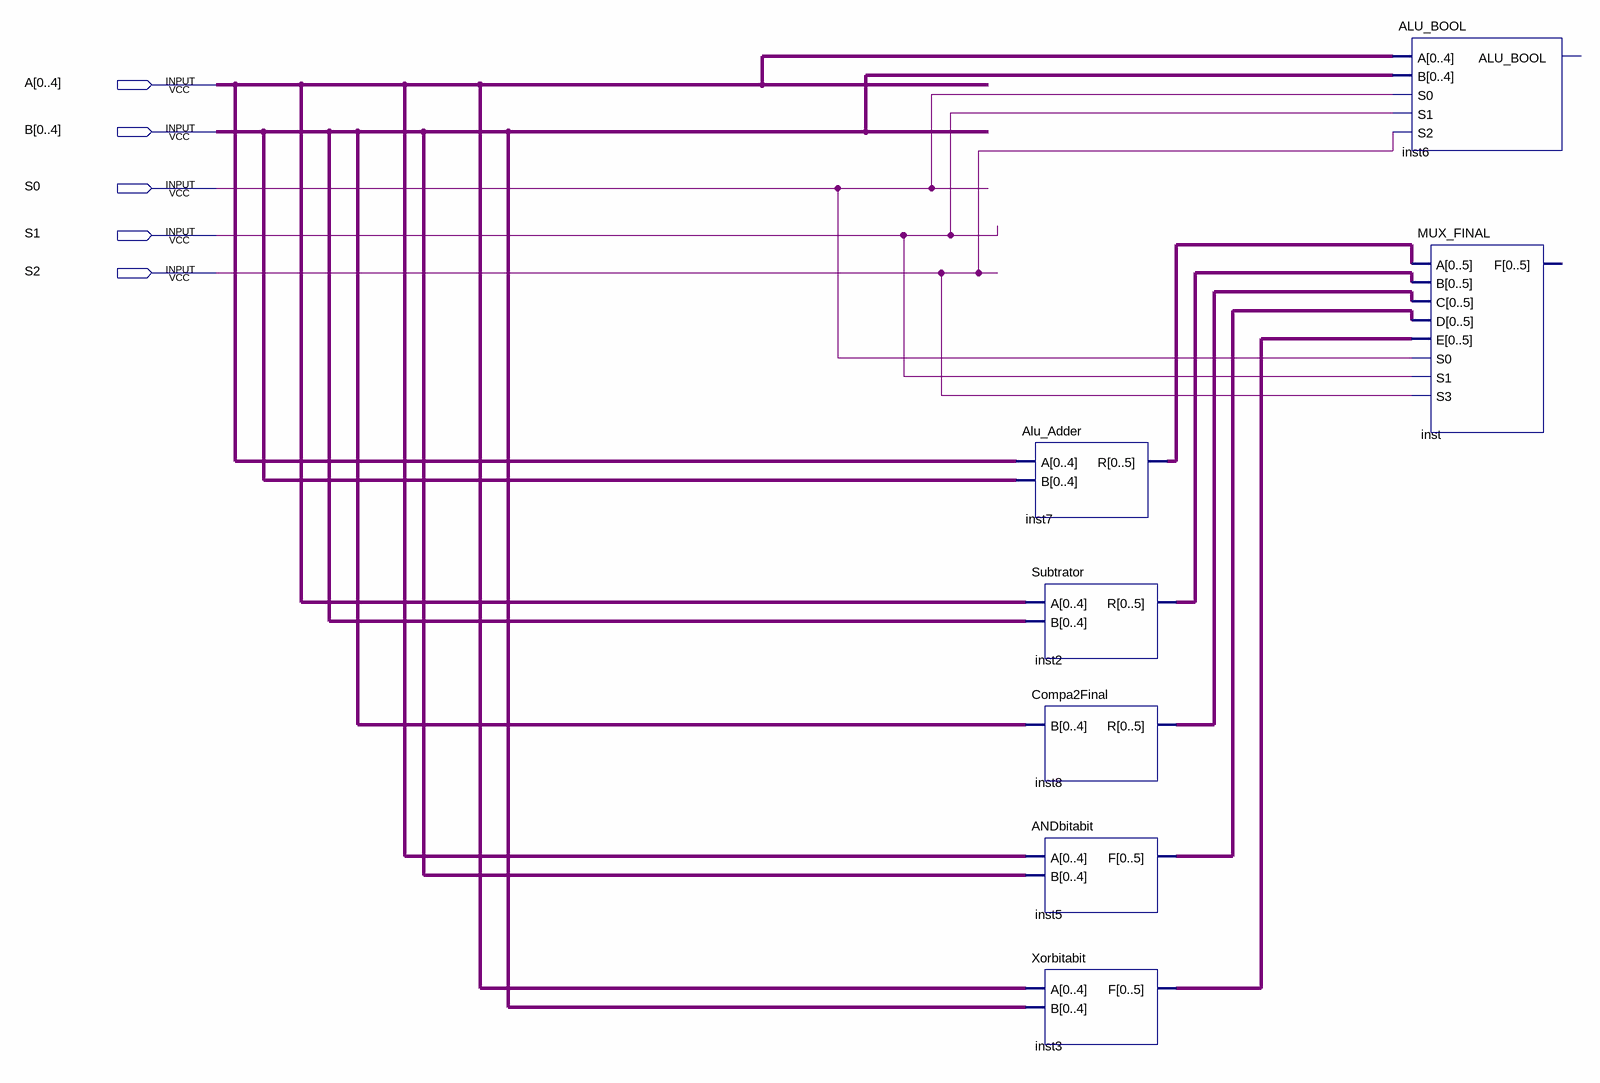
[diagram p0: schematic sheet]
// Quartus schematic alura_final.bdf as structural Verilog: 7 symbols, 5 pins
module alura_final (
  input  [0:4] A,
  input  [0:4] B,
  input  S0,
  input  S1,
  input  S2
);

  wire [5:0] inst2_r, inst3_f, inst5_f, inst7_r, inst8_r;

  Alu_Adder inst7 (.A(A), .B(B), .R(inst7_r));
  Subtrator inst2 (.A(A), .B(B), .R(inst2_r));
  Compa2Final inst8 (.B(B), .R(inst8_r));
  ANDbitabit inst5 (.A(A), .B(B), .F(inst5_f));
  Xorbitabit inst3 (.A(A), .B(B), .F(inst3_f));
  ALU_BOOL inst6 (.A(A), .B(B), .S0(S0), .S1(S1), .S2(S2));  // open: ALU_BOOL
  MUX_FINAL inst (
    .A(inst7_r), .B(inst2_r), .C(inst8_r), .D(inst5_f), .E(inst3_f), .S0(S0), .S1(S1), .S3(S2));  // open: F
endmodule
